# EAGLE schematic Data Logger (EAGLE 6.4)
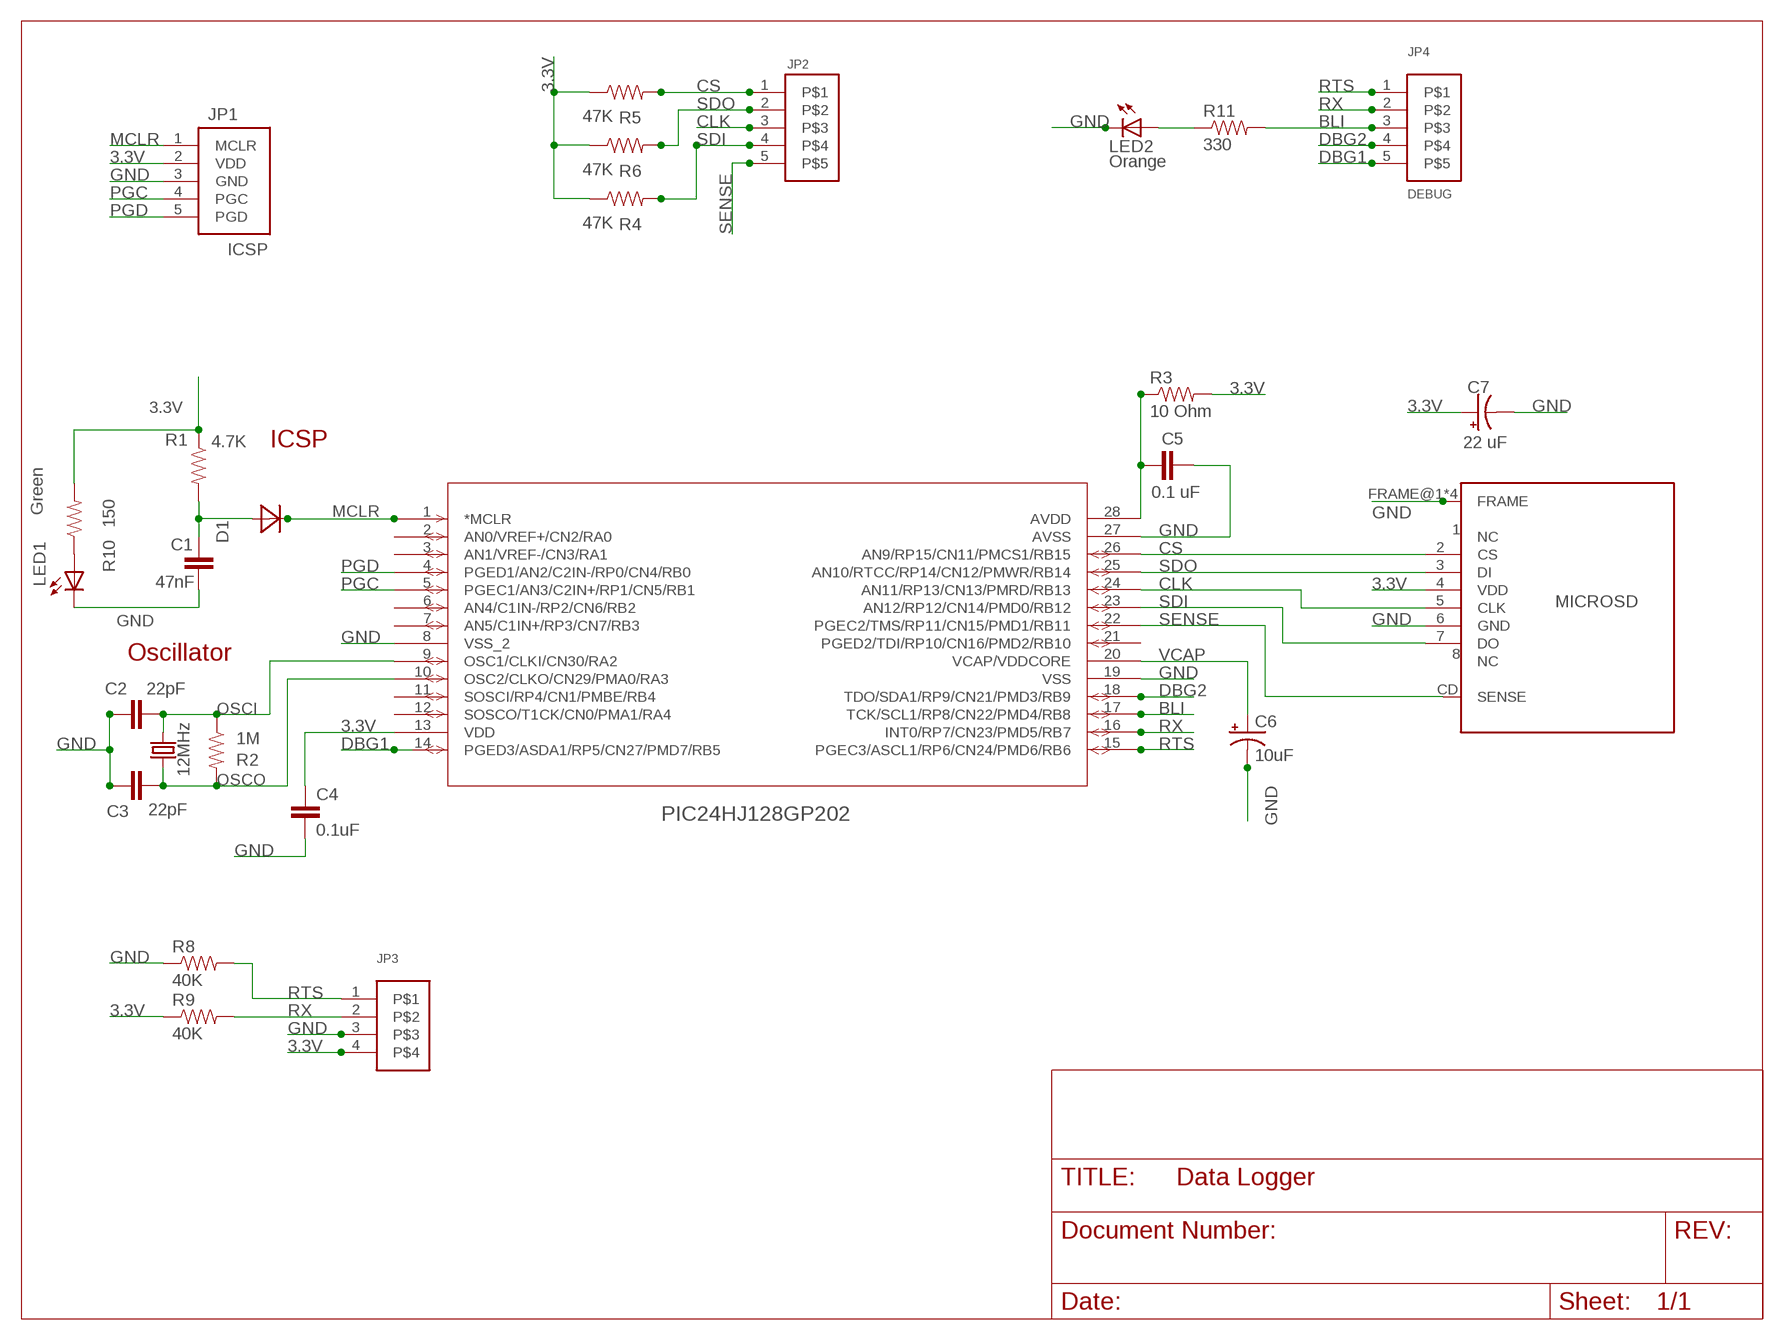
[diagram p0: schematic, sheet 1]

## Parts
C1  47nF  CAP-SMD-CER0805  [0805_INCH-HS-CAP]
C2  22pF  CAP-SMD-CER0805  [0805_INCH-HS-CAP]
C3  22pF  CAP-SMD-CER0805  [0805_INCH-HS-CAP]
C4  0.1uF  CAP-SMD-CER0805  [0805_INCH-HS-CAP]
C5  0.1 uF  CAP-SMD-CER0805  [0805_INCH-HS-CAP]
C6  10uF  CAP-ELE_TTH_5  [CAP-ELE-5MM]
C7  22 uF  CAP-SMD-TANT_C-6032  [TANT-C-6032]
D1  DIODE_TTH  [DO34-5]
JP1  ICSP  ICSP_PRECISE  [1X05-PRECISE]
JP2  HEADER-05_MACHINED  [1X05_MACHINED]
JP3  HEADER-04_PRECISE-NO-SILK  [1X04-PRECISE-NO-SILK]
JP4  DEBUG  HEADER-05_MACHINED  [1X05_MACHINED]
LED1  Green  LED_SMD_1206  [1206_INCH-HS-LED]
LED2  Orange  LED_SMD_1206  [1206_INCH-HS-LED]
Q1  12MHz  CRYSTAL_SMD-5.0X3.2  [CRYSTAL-SMD-5.0X3.2]
R1  4.7K  RES-SMD0805  [0805_INCH-HS]
R2  1M  RES-SMD0805  [0805_INCH-HS]
R3  10 Ohm  RES-SMD0805  [0805_INCH-HS]
R4  47K  RES-SMD0805  [0805_INCH-HS]
R5  47K  RES-SMD0805  [0805_INCH-HS]
R6  47K  RESISTOR_0805  [0805_INCH-HS]
R8  40K  RESISTOR_0805  [0805_INCH-HS]
R9  40K  RESISTOR_0805  [0805_INCH-HS]
R10  150  RESISTOR_0805  [0805_INCH-HS]
R11  330  RESISTOR_0805  [0805_INCH-HS]
U$1  PIC24HJ128GP202  [SOIC28-W_MC]
U$2  MICROSD  [MICROSD_V1]

## Nets
3.3V [PWR]: C4.1 C7.+ JP1.2(VDD) JP3.4 R1.1 R3.2 R4.1 R5.1 R6.1 R9.1 R10.2 U$1.13(VDD) U$2.4(VDD)
BLI: JP4.3 R11.2 U$1.17(TCK/SCL1/RP8/CN22/PMD4/RB8)
CLK: JP2.3 U$1.24(AN11/RP13/CN13/PMRD/RB13) U$2.5(CLK)
CS: JP2.1 R5.2 U$1.26(AN9/RP15/CN11/PMCS1/RB15) U$2.2(CS)
DBG1: JP4.5 U$1.14(PGED3/ASDA1/RP5/CN27/PMD7/RB5)
DBG2: JP4.4 U$1.18(TDO/SDA1/RP9/CN21/PMD3/RB9)
GND [PWR]: C1.2 C2.1 C3.1 C4.2 C5.2 C6.- C7.- JP1.3(GND) JP3.3 LED1.C LED2.C R8.1 U$1.8(VSS_2) U$1.19(VSS) U$1.27(AVSS) U$2.6(GND) U$2.FRAME@1(FRAME) U$2.FRAME@2(FRAME) U$2.FRAME@3(FRAME) U$2.FRAME@4(FRAME)
MCLR: D1.C JP1.1(MCLR) U$1.1(*MCLR)
N$1: C1.1 D1.A R1.2
N$2: C5.1 R3.1 U$1.28(AVDD)
N$3: LED1.A R10.1
N$4: LED2.A R11.1
OSCI: C2.2 Q1.P$2 R2.1 U$1.9(OSC1/CLKI/CN30/RA2)
OSCO: C3.2 Q1.P$1 R2.2 U$1.10(OSC2/CLKO/CN29/PMA0/RA3)
PGC: JP1.4(PGC) U$1.5(PGEC1/AN3/C2IN+/RP1/CN5/RB1)
PGD: JP1.5(PGD) U$1.4(PGED1/AN2/C2IN-/RP0/CN4/RB0)
RTS: JP3.1 JP4.1 R8.2 U$1.15(PGEC3/ASCL1/RP6/CN24/PMD6/RB6)
RX: JP3.2 JP4.2 R9.2 U$1.16(INT0/RP7/CN23/PMD5/RB7)
SDI: JP2.4 R4.2 U$1.23(AN12/RP12/CN14/PMD0/RB12) U$2.7(DO)
SDO: JP2.2 R6.2 U$1.25(AN10/RTCC/RP14/CN12/PMWR/RB14) U$2.3(DI)
SENSE: JP2.5 U$1.22(PGEC2/TMS/RP11/CN15/PMD1/RB11) U$2.CD(SENSE)
VCAP: C6.+ U$1.20(VCAP/VDDCORE)
Unconnected: U$1.2(AN0/VREF+/CN2/RA0) U$1.3(AN1/VREF-/CN3/RA1) U$1.6(AN4/C1IN-/RP2/CN6/RB2) U$1.7(AN5/C1IN+/RP3/CN7/RB3) U$1.11(SOSCI/RP4/CN1/PMBE/RB4) U$1.12(SOSCO/T1CK/CN0/PMA1/RA4) U$1.21(PGED2/TDI/RP10/CN16/PMD2/RB10) U$2.1(NC) U$2.8(NC)

## Notes on the sheet
- ICSP
- Oscillator

## Library data of the parts
C1-C5 = AZ Custom:CAP-SMD-CER
C6 = AZ Custom:CAP-ELE: Capacitor SMD Electrolytic These are standard SMD electrolitic capacitors. Always verify the external diameter of the capacitor as it varies with capacity, voltage, and manufacturer.
C7 = AZ Custom:CAP-SMD-TANT
D1 = AZ Custom:DIODE: Diode
JP1 = AZ Custom:ICSP
JP2 JP4 = AZ Custom:HEADER-05
JP3 = AZ Custom:HEADER-04
LED1 LED2 = AZ Custom:LED: LEDs Standard schematic elements and footprints for 5mm, 3mm, 1206, and 0603 sized LEDs. 5mm - Spark Fun Electronics SKU : COM-00529 (and others)
Q1 = AZ Custom:CRYSTAL: Crystals Various standard crystals. Proven footprints. Spark Fun Electronics SKU : COM-00534
R1-R5 = AZ Custom:RES-SMD
R6 R8-R11 = AZ Custom:RESISTOR
U$1 = AZ Custom:PIC24HJ128GP202
U$2 = AZ Custom:MICROSD

## Net classes
0 default: width 0.203 mm, clearance 0.203 mm
2 PWR: width 0.406 mm, clearance 0.406 mm